# EAGLE design dual_encoder_i2c_shield_revA (EAGLE 8.6.0)
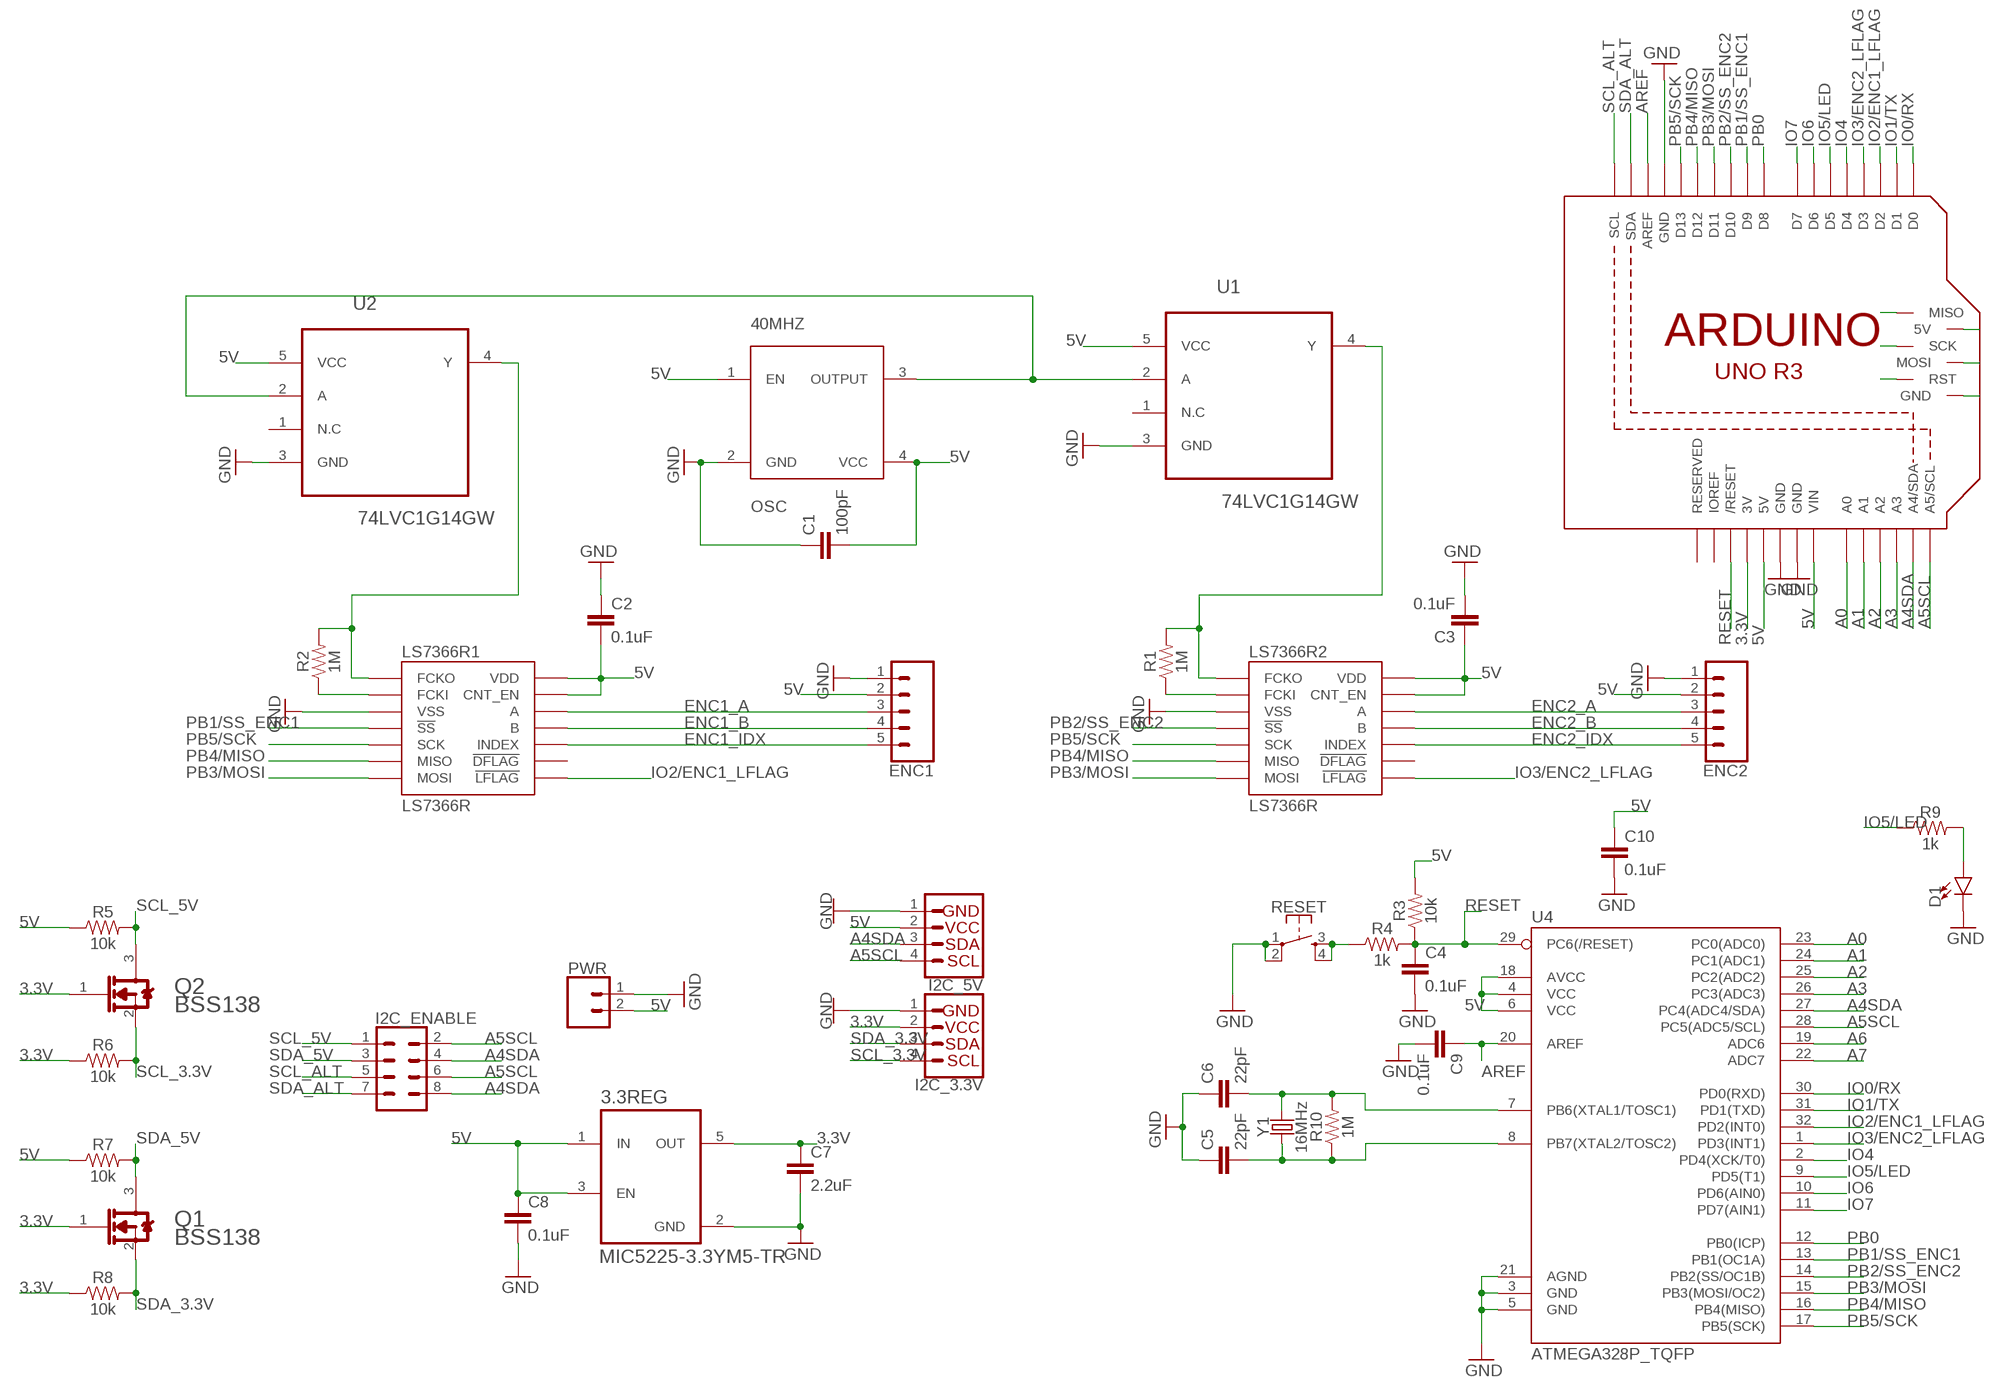
[diagram p0: schematic, sheet 1]

## Parts
3.3REG  MIC5225-3.3YM5-TR  [SOT95P280X145-5N]
40MHZ  OSC  [CB3OSCILLATOR]
C1  100pF  100PF-0603-50V-5%  [0603]
C2  0.1uF  0.1UF-0603-25V-5%  [0603]
C3  0.1uF  0.1UF-0603-25V-5%  [0603]
C4  0.1uF  0.1UF-0603-25V-5%  [0603]
C5  22pF  22PF-0603-50V-5%  [0603]
C6  22pF  22PF-0603-50V-5%  [0603]
C7  2.2uF  2.2UF-0603-10V-20%  [0603]
C8  0.1uF  0.1UF-0603-25V-5%  [0603]
C9  0.1uF  0.1UF-0603-25V-5%  [0603]
C10  0.1uF  0.1UF-0603-25V-5%  [0603]
D1  LED0603  [LED-0603]
ENC1  CONN_05  [1X05]
ENC2  CONN_05  [1X05]
I2C_3.3V  QWIIC_CONNECTORJS-1MM  [JST04_1MM_RA]
I2C_5V  QWIIC_CONNECTORJS-1MM  [JST04_1MM_RA]
I2C_ENABLE  CONN_04X2  [2X4]
LS7366R1  LS7366R  [SOIC14]
LS7366R2  LS7366R  [SOIC14]
M1  ARDUINO_R3_ICSP  [ARDUINOR3_ICSP]
PWR  CONN_02-JST-2MM-SMT  [JST-2-SMD]
Q1  ON_SEMI_BSS138ON_SEMI_BSS138_0_0  [ON_SEMI_BSS138_0]
Q2  ON_SEMI_BSS138ON_SEMI_BSS138_0_0  [ON_SEMI_BSS138_0]
R1  1M  1MOHM-0603-1/4W-5%  [0603]
R2  1M  1MOHM-0603-1/4W-5%  [0603]
R3  10k  10KOHM-0603-1/10W-1%  [0603]
R4  1k  1KOHM-0603-1/10W-1%  [0603]
R5  10k  10KOHM-0603-1/10W-1%  [0603]
R6  10k  10KOHM-0603-1/10W-1%  [0603]
R7  10k  10KOHM-0603-1/10W-1%  [0603]
R8  10k  10KOHM-0603-1/10W-1%  [0603]
R9  1k  1KOHM-0603-1/10W-1%  [0603]
R10  1M  1MOHM-0603-1/4W-5%  [0603]
RESET  MOMENTARY-SWITCH-SPST-2-SMD-5.2MM  [TACTILE_SWITCH_SMD_5.2MM]
U1  74LVC1G14GW  [SOT65P210X110-5N]
U2  74LVC1G14GW  [SOT65P210X110-5N]
U4  ATMEGA328P_TQFP  [TQFP32-08]
Y1  16MHz  CRYSTAL-16MHZPTH-HC49US  [HC49US]

## Nets
3.3V: 3.3REG.5(OUT) C7.1 I2C_3.3V.2 M1.3V Q1.1(G) Q2.1(G) R6.1 R8.1
5V: 3.3REG.1(IN) 3.3REG.3(EN) 40MHZ.1(EN) 40MHZ.4(VCC) C1.2 C2.2 C3.1 C8.1 C10.1 ENC1.2 ENC2.2 I2C_5V.2 LS7366R1.13(CNT_EN) LS7366R1.14(VDD) LS7366R2.13(CNT_EN) LS7366R2.14(VDD) M1.5V M1.5V_ICSP(5V) M1.VIN PWR.2 R3.2 R5.1 R7.1 U1.5(VCC) U2.5(VCC) U4.4(VCC) U4.6(VCC) U4.18(AVCC)
A0: M1.A0 U4.23(PC0(ADC0))
A1: M1.A1 U4.24(PC1(ADC1))
A2: M1.A2 U4.25(PC2(ADC2))
A3: M1.A3 U4.26(PC3(ADC3))
A4SDA: I2C_5V.3 I2C_ENABLE.4 I2C_ENABLE.8 M1.A4(A4/SDA) U4.27(PC4(ADC4/SDA))
A5SCL: I2C_5V.4 I2C_ENABLE.2 I2C_ENABLE.6 M1.A5(A5/SCL) U4.28(PC5(ADC5/SCL))
A6: U4.19(ADC6)
A7: U4.22(ADC7)
AREF: C9.1 M1.AREF U4.20(AREF)
ENC1_A: ENC1.3 LS7366R1.12(A)
ENC1_B: ENC1.4 LS7366R1.11(B)
ENC1_IDX: ENC1.5 LS7366R1.10(INDEX)
ENC2_A: ENC2.3 LS7366R2.12(A)
ENC2_B: ENC2.4 LS7366R2.11(B)
ENC2_IDX: ENC2.5 LS7366R2.10(INDEX)
GND: 3.3REG.2(GND) 40MHZ.2(GND) C1.1 C2.1 C3.2 C4.2 C5.1 C6.1 C7.2 C8.2 C9.2 C10.2 D1.C ENC1.1 ENC2.1 I2C_3.3V.1 I2C_5V.1 LS7366R1.3(VSS) LS7366R2.3(VSS) M1.GND M1.GND@1(GND) M1.GND@2(GND) M1.GND@3(GND) PWR.1 RESET.1 RESET.2 U1.3(GND) U2.3(GND) U4.3(GND) U4.5(GND) U4.21(AGND)
IO0/RX: M1.D0 U4.30(PD0(RXD))
IO1/TX: M1.D1 U4.31(PD1(TXD))
IO2/ENC1_LFLAG: LS7366R1.8(!LFLAG) M1.D2 U4.32(PD2(INT0))
IO3/ENC2_LFLAG: LS7366R2.8(!LFLAG) M1.D3 U4.1(PD3(INT1))
IO4: M1.D4 U4.2(PD4(XCK/T0))
IO5/LED: M1.D5 R9.1 U4.9(PD5(T1))
IO6: M1.D6 U4.10(PD6(AIN0))
IO7: M1.D7 U4.11(PD7(AIN1))
N$2: R4.1 RESET.3 RESET.4
N$3: D1.A R9.2
N$5: C6.2 R10.2 U4.7(PB6(XTAL1/TOSC1)) Y1.2
N$6: LS7366R1.2(FCKI) R2.1
N$7: 40MHZ.3(OUTPUT) U1.2(A) U2.2(A)
N$8: LS7366R2.1(FCKO) R1.2 U1.4(Y)
N$9: LS7366R2.2(FCKI) R1.1
N$10: LS7366R1.1(FCKO) R2.2 U2.4(Y)
N$11: C5.2 R10.1 U4.8(PB7(XTAL2/TOSC2)) Y1.1
PB0: M1.D8 U4.12(PB0(ICP))
PB1/SS_ENC1: LS7366R1.4(!SS) M1.D9 U4.13(PB1(OC1A))
PB2/SS_ENC2: LS7366R2.4(!SS) M1.D10 U4.14(PB2(SS/OC1B))
PB3/MOSI: LS7366R1.7(MOSI) LS7366R2.7(MOSI) M1.D11 M1.MOSI U4.15(PB3(MOSI/OC2))
PB4/MISO: LS7366R1.6(MISO) LS7366R2.6(MISO) M1.D12 M1.MISO U4.16(PB4(MISO))
PB5/SCK: LS7366R1.5(SCK) LS7366R2.5(SCK) M1.D13 M1.SCK U4.17(PB5(SCK))
RESET: C4.1 M1.RESET(/RESET) M1.RESET_ICSP(RST) R3.1 R4.2 U4.29(PC6(/RESET))
SCL_3.3V: I2C_3.3V.4 Q2.2(S) R6.2
SCL_5V: I2C_ENABLE.1 Q2.3(D) R5.2
SCL_ALT: I2C_ENABLE.5 M1.SCL
SDA_3.3V: I2C_3.3V.3 Q1.2(S) R8.2
SDA_5V: I2C_ENABLE.3 Q1.3(D) R7.2
SDA_ALT: I2C_ENABLE.7 M1.SDA
Unconnected: LS7366R1.9(!DFLAG) LS7366R2.9(!DFLAG) M1.IOREF M1.RESERVED U1.1(N.C) U2.1(N.C)

## Library data of the parts
3.3REG = MIC5225-3.3YM5-TR:MIC5225-3.3YM5-TR: MIC5225 Series 150 mA 3.3 V Fixed Output Surface Mount LDO Regulator SOT-23-5; AVAILABILITY: Unavailable; DESCRIPTION: Linear Voltage Regulator IC 1 Output 150mA SOT-23-5; MF: Microchip; MP: MIC5225-3.3YM5-TR; PACKAGE: SOT-23 Microchip; PRICE: None
40MHZ = steveo:OSC: CB3 40mhz Oscillator smd
C1 = SparkFun-Capacitors:100PF: 100pF/0.1nF ceramic capacitors A capacitor is a passive two-terminal electrical component used to store electrical energy temporarily in an electric field.; PROD_ID: CAP-07883
C2-C4 C8-C10 = SparkFun-Capacitors:0.1UF: 0.1µF ceramic capacitors A capacitor is a passive two-terminal electrical component used to store electrical energy temporarily in an electric field.; PROD_ID: CAP-08604
C5 C6 = SparkFun-Capacitors:22PF: 22pF ceramic capacitors A capacitor is a passive two-terminal electrical component used to store electrical energy temporarily in an electric field.; PROD_ID: CAP-07876
C7 = SparkFun-Capacitors:2.2UF: 2.2µF ceramic capacitors A capacitor is a passive two-terminal electrical component used to store electrical energy temporarily in an electric field.; PROD_ID: CAP-07888
D1 = SparkFun-LED:LED: LED (Generic) Standard schematic elements and footprints for 5mm, 3mm, 1206, and 0603 sized LEDs. Generic LEDs with no color specified.
ENC1 ENC2 = SparkFun-Connectors:CONN_05: Multi connection point. Often used as Generic Header-pin footprint for 0.1 inch spaced/style header connections On any of the 0.1 inch spaced packages, you can populate with these: Break Away Headers - Straight <https://www.sparkfun.com/products/116> (PRT-00116) Break Away Male Headers - Right Angle <https://www.sparkfun.com/products/553> (PRT-00553) Female Headers <https://www.sparkfun.com/products/115> (PRT-00115) Break Away Headers - Machine Pin <https://www.sparkfun.com/products/117> (PRT-00117) Break Away Female Headers - Swiss Machine Pin <https://www.sparkfun.com/products/743> (PRT-00743) For SCREWTERMINALS and SPRING TERMINALS visit here: Screw Terimnals on SparkFun.com <https://www.sparkfun.com/search/results?term=Screw+Terminals> (5mm/3.5mm/2.54mm spacing) This device is also useful as a general connection point to wire up your design to another part of your project. Our various solder wires solder well into these plated through hole pads. Hook-Up Wire - Assortment (Stranded, 22 AWG) <https://www.sparkfun.com/products/11375> (PRT-11375) Hook-Up Wire - Assortment (Solid Core, 22 AWG) <https://www.sparkfun.com/products/11367> (PRT-11367) View the entire wire category on our website here <https://www.sparkfun.com/categories/141> Special notes: Molex polarized connector foot print use with SKU : PRT-08231 with associated crimp pins and housings. 1MM SMD Version SKU: PRT-10208
I2C_3.3V I2C_5V = SparkFun-Connectors:QWIIC_CONNECTOR: SparkFun I2C Standard Qwiic Connector An SMD 1mm pitch JST connector makes it easy and quick (get it? Qwiic?) to connect I2C devices to each other. The Qwiic system <http://www.sparkfun.com/qwiic> enables fast and solderless connection between popular platforms and various sensors and actuators. We carry 200mm <https://www.sparkfun.com/products/14204>, 100mm <https://www.sparkfun.com/products/14205>, 50mm <https://www.sparkfun.com/products/14206>, and breadboard friendly <https://www.sparkfun.com/products/14207> Qwiic cables. We also offer 10 pcs strips <https://www.sparkfun.com/products/14323> the SMD connectors.; PROD_ID: CONN-13694
I2C_ENABLE = SparkFun-Connectors:CONN_04X2: Multi connection point. Often used as Generic Header-pin footprint for 0.1 inch spaced/style header connections On any of the 0.1 inch spaced packages, you can populate with these: Break Away Headers - Straight <https://www.sparkfun.com/products/116> (PRT-00116) Break Away Male Headers - Right Angle <https://www.sparkfun.com/products/553> (PRT-00553) Female Headers <https://www.sparkfun.com/products/115> (PRT-00115) Break Away Headers - Machine Pin <https://www.sparkfun.com/products/117> (PRT-00117) Break Away Female Headers - Swiss Machine Pin <https://www.sparkfun.com/products/743> (PRT-00743)
LS7366R1 LS7366R2 = LS7366R:LS7366R; AVAILABILITY: Unavailable; MF: LSI; MP: LS7366R; PACKAGE: None; PRICE: None
M1 = adafruit:ARDUINO_R3_ICSP
PWR = SparkFun-Connectors:CONN_02: Multi connection point. Often used as Generic Header-pin footprint for 0.1 inch spaced/style header connections On any of the 0.1 inch spaced packages, you can populate with these: Break Away Headers - Straight <https://www.sparkfun.com/products/116> (PRT-00116) Break Away Male Headers - Right Angle <https://www.sparkfun.com/products/553> (PRT-00553) Female Headers <https://www.sparkfun.com/products/115> (PRT-00115) Break Away Headers - Machine Pin <https://www.sparkfun.com/products/117> (PRT-00117) Break Away Female Headers - Swiss Machine Pin <https://www.sparkfun.com/products/743> (PRT-00743) For SCREWTERMINALS and SPRING TERMINALS visit here: Screw Terimnals on SparkFun.com <https://www.sparkfun.com/search/results?term=Screw+Terminals> (5mm/3.5mm/2.54mm spacing) This device is also useful as a general connection point to wire up your design to another part of your project. Our various solder wires solder well into these plated through hole pads. Hook-Up Wire - Assortment (Stranded, 22 AWG) <https://www.sparkfun.com/products/11375> (PRT-11375) Hook-Up Wire - Assortment (Solid Core, 22 AWG) <https://www.sparkfun.com/products/11367> (PRT-11367) View the entire wire category on our website here <https://www.sparkfun.com/categories/141> Special notes: Molex polarized connector foot print use with: PRT-08233 with associated crimp pins and housings. 2.54_SCREWTERM for use with PRT-10571. 3.5mm Screw Terminal footprints for PRT-08084 5mm Screw Terminal footprints for use with PRT-08432; PROD_ID: CONN-11443
Q1 Q2 = ON Semi - BSS138:ON_SEMI_BSS138: N-Channel Logic Level Enhancement Mode Field Effect Transistor; CENTROID_NOT_SPECIFIED: No; DATASHEET: https://www.fairchildsemi.com/datasheets/BS/BSS138.pdf; DIGIKEY_DESCRIPTION: TRANS MOSFET N-CH 50V 220MA SOT-23; DIGIKEY_PART_NUMBER: BSS138CT-ND; LEAD_FREE: yes; MF: ON Semi; MFG_PACKAGE_IDENT: BSS138; MFG_PACKAGE_IDENT_DATE: 0; MFG_PACKAGE_IDENT_REV: 0; MOUSER_DESCRIPTION: MOSFET SOT-23 N-CH LOGIC; MOUSER_PART_NUMBER: 512-BSS138; MPN: BSS138; PACKAGE: SOT23; PREFIX: Q; ROHS: yes; TEMPERATURE_RANGE_HIGH: +150°C; TEMPERATURE_RANGE_LOW: -55°C
R1 R2 R10 = SparkFun-Resistors:1MOHM: 1MΩ resistor A resistor is a passive two-terminal electrical component that implements electrical resistance as a circuit element. Resistors act to reduce current flow, and, at the same time, act to lower voltage levels within circuits. - Wikipedia; PROD_ID: RES-07868
R3 R5-R8 = SparkFun-Resistors:10KOHM: 10kΩ resistor A resistor is a passive two-terminal electrical component that implements electrical resistance as a circuit element. Resistors act to reduce current flow, and, at the same time, act to lower voltage levels within circuits. - Wikipedia; PROD_ID: RES-00824
R4 R9 = SparkFun-Resistors:1KOHM: 1kΩ resistor A resistor is a passive two-terminal electrical component that implements electrical resistance as a circuit element. Resistors act to reduce current flow, and, at the same time, act to lower voltage levels within circuits. - Wikipedia; PROD_ID: RES-07856
RESET = SparkFun-Switches:MOMENTARY-SWITCH-SPST-2: Momentary Switch (Pushbutton) - SPST - Two Circuits Normally-open (NO) SPST momentary switches (buttons, pushbuttons). Schematic symbol includes two switch circuits. Variants SMD-4.6MMX2.8MM - 4.60mm x 2.80mm Tactile Momentary Button Switch - Used on SparkFun SAMD21 Mini Breakout <https://www.sparkfun.com/products/13664> SMD-5.2MM - Mini Pushbutton Switch - SMD <https://www.sparkfun.com/products/8720> - Used on Arduino Pro Mini <https://www.sparkfun.com/products/11114>; PROD_ID: SWCH-08247; SF_SKU: COM-08720
U1 U2 = 74LVC1G14GW:74LVC1G14GW: Single Schmitt-trigger inverter; AVAILABILITY: Unavailable; DESCRIPTION: IC MOS 74LVC1G14/SO/74LVC1G14GW PHILIPS RoHS LVC SOt23; MF: NXP Semiconductors; MP: 74LVC1G14GW; PACKAGE: TSSOP-5 NXP Semiconductors; PRICE: 214.47 USD
U4 = SparkFun-IC-Microcontroller:ATMEGA328P_TQFP: Popular 328P in QFP Storefront component: ATmega328 - TQFP <https://www.sparkfun.com/products/13448> (COM-13448) Datasheet <http://www.sparkfun.com/datasheets/Components/SMD/ATMega328.pdf> SparkFun Products SparkFun RedBoard - Programmed with Arduino <https://www.sparkfun.com/products/12757> (DEV-12757) Arduino Pro Mini 328 - 5V/16MHz <https://www.sparkfun.com/products/11113> (DEV-11113) Arduino Pro Mini 328 - 3.3V/8MHz <https://www.sparkfun.com/products/11114> (DEV-11114) SparkFun OpenLog <https://www.sparkfun.com/products/13712> (DEV-13712) SparkFun MicroView - OLED Arduino Module <https://www.sparkfun.com/products/12923> (DEV-12923) SparkFun Digital Sandbox <https://www.sparkfun.com/products/12651> (DEV-12651) SparkFun PicoBoard <https://www.sparkfun.com/products/11888> (WIG-11888) Arduino Fio <https://www.sparkfun.com/products/10116> (DEV-10116) LilyPad Arduino 328 Main Board <https://www.sparkfun.com/products/13342> (DEV-13342) SparkFun RedStick <https://www.sparkfun.com/products/13741> (DEV-13741) LilyPad MP3 <https://www.sparkfun.com/products/11013> (DEV-11013) LilyPad Arduino SimpleSnap <https://www.sparkfun.com/products/10941> (DEV-10941) SparkFun Stepoko <https://www.sparkfun.com/products/13899> (ROB-13899) SparkFun Geiger Counter <https://www.sparkfun.com/products/11345> (SEN-11345) SparkFun EL Sequencer <https://www.sparkfun.com/products/12781> (COM-12781) Arduino Pro 328 - 5V/16MHz <https://www.sparkfun.com/products/10915> (DEV-10915) CryptoCape <https://www.sparkfun.com/products/12773> (DEV-12773) SparkFun IR Thermometer Evaluation Board - MLX90614 <https://www.sparkfun.com/products/10740> (SEN-10740) SparkFun RedBot Mainboard <https://www.sparkfun.com/products/12097> (ROB-12097) Arduino Pro 328 - 3.3V/8MHz <https://www.sparkfun.com/products/10914> (DEV-10914) SparkFun Block for Intel® Edison - Arduino <https://www.sparkfun.com/products/13036> (DEV-13036) SparkFun Simon Says - Surface Mount Soldering Kit <https://www.sparkfun.com/products/10935> (KIT-10935) SparkFun 7-Segment Serial Display - Red <https://www.sparkfun.com/products/11441> (COM-11441) SparkFun 7-Segment Serial Display - White <https://www.sparkfun.com/products/11629> (COM-11629) SparkFun 7-Segment Serial Display - Yellow <https://www.sparkfun.com/products/11443> (COM-11443) SparkFun 7-Segment Serial Display - Kelly Green <https://www.sparkfun.com/products/11440> (COM-11440) SparkFun 7-Segment Serial Display - Blue <https://www.sparkfun.com/products/11442> (COM-11442) SparkFun OpenSegment Serial Display - 20mm (Blue) <https://www.sparkfun.com/products/11647> (COM-11647) SparkFun OpenSegment Serial Display - 20mm (Green) <https://www.sparkfun.com/products/11646> (COM-11646) SparkFun OpenSegment Serial Display - 20mm (White) <https://www.sparkfun.com/products/11648> (COM-11648) SparkFun OpenSegment Serial Display - 20mm (Red) <https://www.sparkfun.com/products/11644> (COM-11644) SparkFun OpenSegment Serial Display - 20mm (Yellow) <https://www.sparkfun.com/products/11645> (COM-11645) SparkFun OpenSegment Shield <https://www.sparkfun.com/products/13190> (DEV-13190); PROD_ID: IC-09069
Y1 = SparkFun-Clocks:CRYSTAL-16MHZ: 16MHz Crystal Digikey Example <http://www.digikey.com/product-search/en?keywords=535-9122-1-ND> Frequency: 16MHz Frequency Stability: ±50ppm Frequency Tolerance: ±20ppm Load Capacitance: 18pF SparkFun Products: Pro Micro -5V/16MHz <https://www.sparkfun.com/products/12640> SparkFun Serial Enabled LCD Kit <https://www.sparkfun.com/products/10097>; PROD_ID: XTAL-08181; SF_ID: COM-00536

## Board
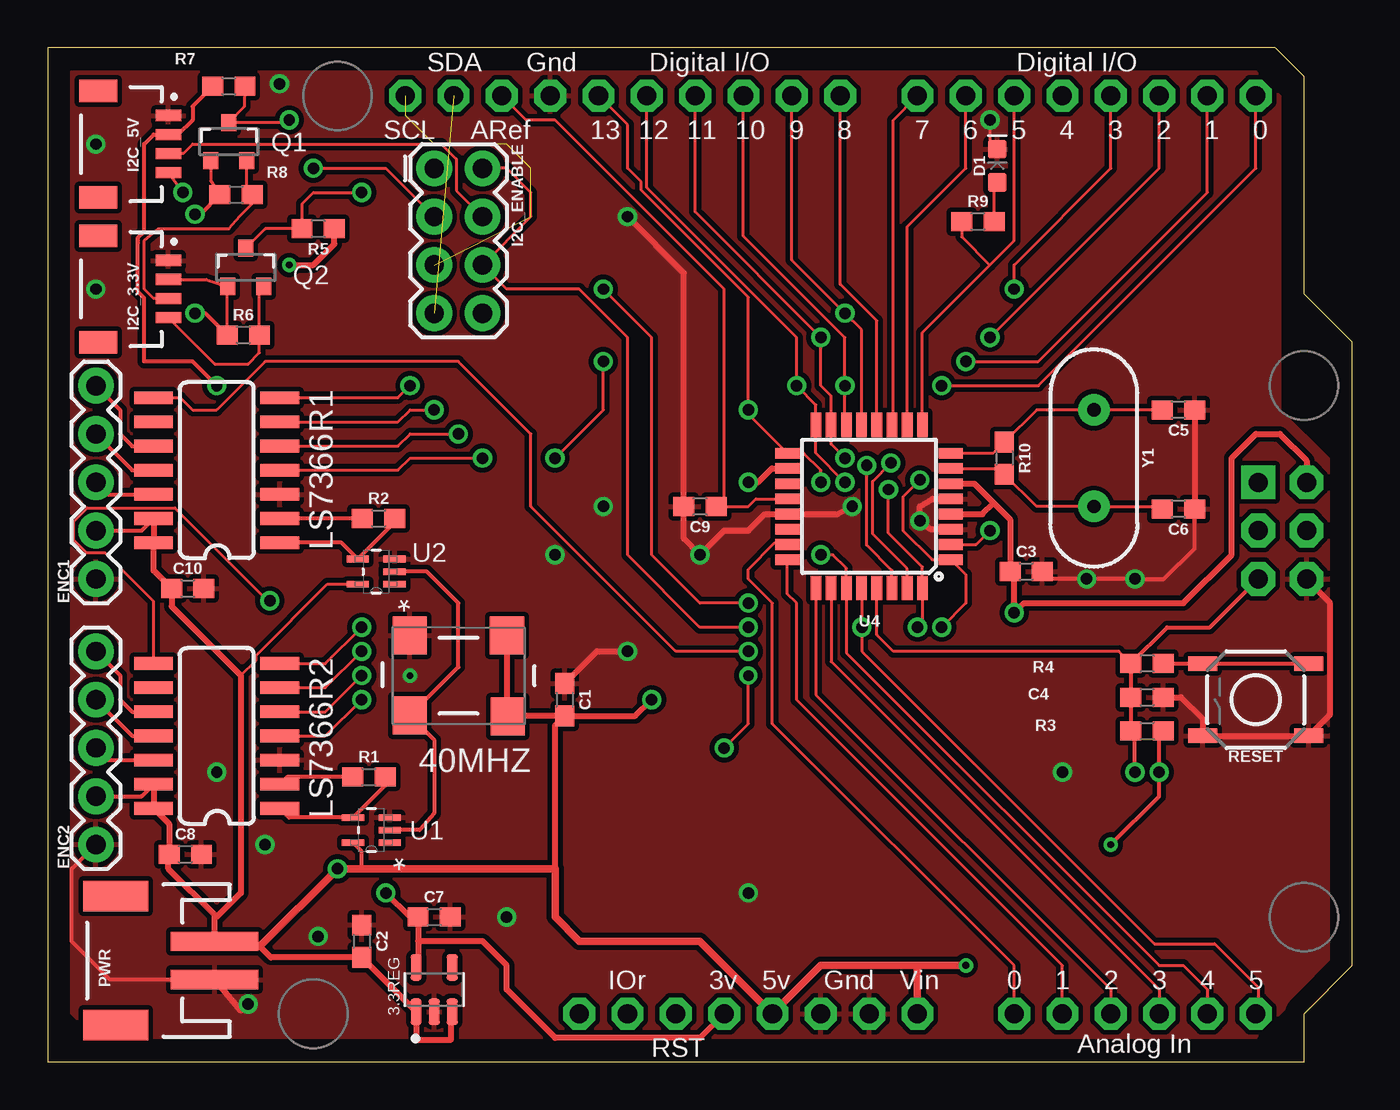
[diagram p1: board, top side]
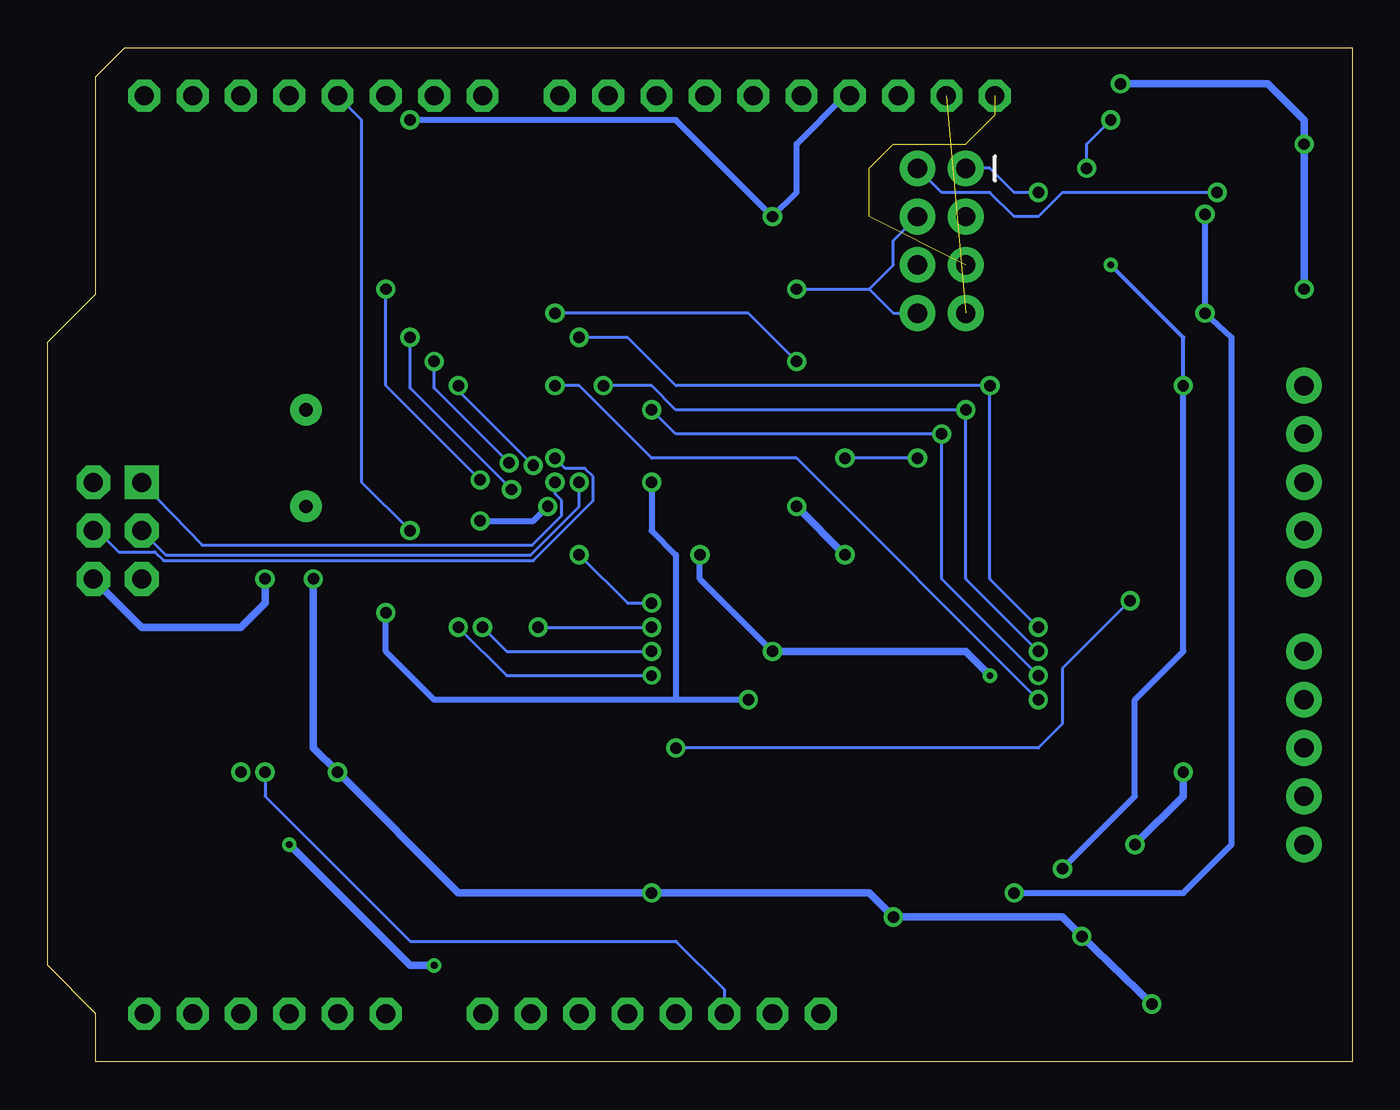
[diagram p2: board, bottom side, seen from below]

Size 68.58 x 53.34 mm. Coordinates in mm from the lower left corner, seen from the top.
Copper layers (1*16): Top 0.035mm / dielectric 1.5mm / Bottom 0.035mm
Design rules "default": minimum track width 6mil, minimum drill 0.35mm, track to track 6mil, track to pad 6mil, pad to pad 6mil, via to via 6mil, smd to smd 6mil, copper to edge 40mil, drill to drill 6mil, minimum pad ring 10mil, minimum via ring 8mil, stop-mask expansion 4mil, vias tented up to drill 0mil, thermal gap 10mil

### Footprints (pad centres in the part's own frame; a part is rotated, then mirrored left to right if it is on the bottom)
SOT95P280X145-5N = smd 1.39 x 0.58: 1 -1.165,0.95; 2 -1.165,0; 3 -1.165,-0.95; 4 1.165,-0.95; 5 1.165,0.95
CB3OSCILLATOR = smd 1.8 x 2: 1 -2.55,-2.1; 2 2.55,-2.1; 3 2.55,2.1; 4 -2.6,2.15
0603 = smd 1.1 x 1: 1 -0.85,0; 2 0.85,0
LED-0603 = smd 1 x 1: A -0.877,0; C 0.877,0
1X05 = drill 1.016 pad 1.88: 1 0,0; 2 2.54,0; 3 5.08,0; 4 7.62,0; 5 10.16,0
JST04_1MM_RA = smd 0.6 x 1.35: 1 -1.5,0; 2 -0.5,0; 3 0.5,0; 4 1.5,0 | smd 1.2 x 2: NC1 2.8,-3.675; NC2 -2.8,-3.675
2X4 = drill 1.016 pad 1.88: 1 -3.81,-1.27; 2 -3.81,1.27; 3 -1.27,-1.27; 4 -1.27,1.27; 5 1.27,-1.27; 6 1.27,1.27; 7 3.81,-1.27; 8 3.81,1.27
SOIC14 = smd 2.032 x 0.66: 1 -3.315,4.445; 2 -3.315,3.175; 3 -3.315,1.905; 4 -3.315,0.635; 5 -3.315,-0.635; 6 -3.315,-1.905; 7 -3.315,-3.175; 8 3.315,-3.175; 9 3.315,-1.905; 10 3.315,-0.635; 11 3.315,0.635; 12 3.315,1.905; 13 3.315,3.175; 14 3.315,4.445
ARDUINOR3_ICSP = drill 1 pad 1.676 octagon: 3V 35.56,2.54; 5V 38.1,2.54; A0 50.8,2.54; A1 53.34,2.54; A2 55.88,2.54; A3 58.42,2.54; A4 60.96,2.54; A5 63.5,2.54; AREF 23.876,50.8; D0 63.5,50.8; D1 60.96,50.8; D2 58.42,50.8; D3 55.88,50.8; D4 53.34,50.8; D5 50.8,50.8; D6 48.26,50.8; D7 45.72,50.8; D8 41.656,50.8; D9 39.116,50.8; D10 36.576,50.8; D11 34.036,50.8; D12 31.496,50.8; D13 28.956,50.8; GND 26.416,50.8; GND@1 43.18,2.54; GND@2 40.64,2.54; IOREF 30.48,2.54; RESERVED 27.94,2.54; RESET 33.02,2.54; SCL 18.796,50.8; SDA 21.336,50.8; VIN 45.72,2.54 | drill 1 pad 1.778 octagon: 5V_ICSP 66.167,30.48; GND@3 66.167,25.4; MOSI 66.167,27.94; RESET_ICSP 63.627,25.4; SCK 63.627,27.94 | drill 1 pad 1.778 square: MISO 63.627,30.48
JST-2-SMD = smd 1 x 4.6: 1 -1,-3.7; 2 1,-3.7 | smd 1.6 x 3.4: NC1 -3.4,1.5; NC2 3.4,1.5
ON_SEMI_BSS138_0 = smd 0.8 x 0.9: 1 -0.95,-1; 2 0.95,-1; 3 0,1
TACTILE_SWITCH_SMD_5.2MM = smd 1.524 x 0.762: 1 -2.794,1.905; 2 2.794,1.905; 3 -2.794,-1.905; 4 2.794,-1.905
SOT65P210X110-5N = smd 1.168 x 0.356: 1 -0.965,0.66; 2 -0.965,0; 3 -0.965,-0.66; 4 0.965,-0.66; 5 0.965,0.66
TQFP32-08 = smd 1.27 x 0.559: 1 -4.293,2.8; 2 -4.293,2; 3 -4.293,1.2; 4 -4.293,0.4; 5 -4.293,-0.4; 6 -4.293,-1.2; 7 -4.293,-2; 8 -4.293,-2.8; 17 4.293,-2.8; 18 4.293,-2; 19 4.293,-1.2; 20 4.293,-0.4; 21 4.293,0.4; 22 4.293,1.2; 23 4.293,2; 24 4.293,2.8 | smd 0.559 x 1.27: 9 -2.8,-4.293; 10 -2,-4.293; 11 -1.2,-4.293; 12 -0.4,-4.293; 13 0.4,-4.293; 14 1.2,-4.293; 15 2,-4.293; 16 2.8,-4.293; 25 2.8,4.293; 26 2,4.293; 27 1.2,4.293; 28 0.4,4.293; 29 -0.4,4.293; 30 -1.2,4.293; 31 -2,4.293; 32 -2.8,4.293
HC49US = drill 0.7 pad 1.651: 1 -2.54,0; 2 2.54,0

### Placement (x,y rotation side)
3.3REG  20.32,3.81 90 top
40MHZ  21.59,20.32 180 top
C1  27.18,19.05 270 top
C2  16.51,6.35 270 top
C3  51.44,25.78 0 top
C4  57.78,19.18 0 top
C5  59.44,34.29 180 top
C6  59.44,29.08 180 top
C7  20.32,7.62 0 top
C8  7.24,10.92 0 top
C9  34.29,29.21 180 top
C10  7.37,24.89 0 top
D1  49.91,47.12 90 top
ENC1  2.54,25.4 90 top
ENC2  2.54,11.43 90 top
I2C_3.3V  6.35,40.64 270 top
I2C_5V  6.35,48.26 270 top
I2C_ENABLE  21.59,43.18 270 top
LS7366R1  8.89,31.75 180 top
LS7366R2  8.89,17.78 180 top
M1  0,0 0 top
PWR  5.08,5.33 90 top
Q1  9.53,48.39 0 top
Q2  10.41,41.78 0 top
R1  16.89,14.99 0 top
R2  17.4,28.57 0 top
R3  57.78,17.4 0 top
R4  57.78,20.95 180 top
R5  14.22,43.81 180 top
R6  10.29,38.23 0 top
R7  9.53,51.31 0 top
R8  9.91,45.59 0 top
R9  48.9,44.2 0 top
R10  50.29,31.75 270 top
RESET  63.5,19.05 180 top
U1  17.02,12.19 180 top
U2  17.27,25.78 180 top
U4  43.18,29.21 180 top
Y1  54.99,31.75 270 top

### Tracks (layer width: path | path; a pad name or v marks a point on that pad's centre or on a via)
3.3V  (via drill 0.6)
  Top 0.152: Q1.1 8.57,46.33 R8.1 | I2C_3.3V.2 8.35,41.14 8.98,40.94 | 8.98,40.94 Q2.1 | R6.1 9.44,40.48 8.98,40.94
  Top 0.203: v7.75,44.58 8.04,44.58 R8.1 | R6.1 8.29,39.37 v7.75,39.37
  Top 0.305: 19.47,6.35 C7.1 19.05,7.62 v17.78,8.89 | 19.47,6.35 19.47,5.08 3.3REG.5 19.37,4.76 | M1.3V 34.29,1.27 26.67,1.27 24.13,3.81 24.13,5.08 22.86,6.35 19.47,6.35
  Bottom 0.305: v17.78,8.89 8.89,8.89 6.35,11.43 6.35,38.1 v7.75,39.37 v7.75,44.58
5V  (via drill 0.35, 0.6)
  Top 0.152: 10.16,20.32 10.96,21.12 10.96,21.38 14.7,25.12 U2.5
  Top 0.203: ENC2.2 4.94,13.97 LS7366R2.13 | ENC1.2 4.94,27.94 LS7366R1.13 | 16.51,10.16 16.51,11.07 U1.5 | R7.1 7.62,50.25 7.62,49.53 6.85,48.76 I2C_5V.2 5.58,48.76 5.08,48.26 5.08,43.66 4.75,43.33 4.75,43.2 4.74,43.07 4.75,43.06 4.75,40.5 5.08,40.17 5.08,36.83 7.62,36.83 v8.89,35.56 | R3.2 58.42,17.18 v58.42,15.24 58.42,13.97 v55.88,11.43
  Top 0.305: LS7366R2.13 LS7366R2.14 6.39,12.52 C8.1 6.35,10.88 6.35,10.16 8.78,7.73 | LS7366R1.13 LS7366R1.14 5.58,25.83 C10.1 6.52,23.96 10.16,20.32 10.16,8.89 8.89,7.62 8.78,7.73 | 40MHZ.1 24.14,18.22 24.16,18.2 | 24.16,18.2 40MHZ.4 | C1.2 24.16,18.2 | PWR.2 8.78,7.73 | 3.3REG.3 21.21,2.58 21.21,1.17 19.43,1.17 19.37,1.23 3.3REG.1 C2.2 11.74,5.5 11.16,6.08 | 26.67,10.16 26.67,17.69 C1.2 | 50.42,25.61 C3.1 | C3.1 50.59,28.54 49.72,29.4 | C1.2 30.9,18.2 v31.75,19.05 | U4.6 48.71,30.41 49.72,29.4 | U4.4 49.13,28.81 49.72,29.4 | C3.1 50.8,25.57 v50.8,23.62 51.31,24.13 59.69,24.13 62.23,26.67 62.23,31.75 63.5,33.02 64.77,33.02 66.17,31.62 M1.5V_ICSP | v36.83,30.48 37.34,30.48 38.07,31.21 U4.18 | v12.7,41.91 13.97,41.91 15.07,43.01 R5.1
  Top 0.406: PWR.2 11.16,6.08 v15.24,10.16 16.51,10.16 26.67,10.16 26.67,7.62 27.94,6.35 34.29,6.35 M1.5V 40.64,5.08 45.72,5.08 | 45.72,5.08 M1.VIN | 45.72,5.08 v48.26,5.08
  Bottom 0.203: v8.89,35.56 8.89,38.1 v12.7,41.91
  Bottom 0.305: v31.75,19.05 35.56,19.05 | 35.56,19.05 48.26,19.05 50.8,21.59 v50.8,23.62 | v36.83,30.48 36.83,27.94 35.56,26.67 35.56,19.05 | v15.24,10.16 11.43,13.97 11.43,19.05 8.89,21.59 v8.89,35.56
  Bottom 0.406: v48.26,5.08 49.53,5.08 v55.88,11.43
A0
  Top 0.152: M1.A0 50.8,5.08 38.1,17.78 38.1,24.13 36.83,25.4 36.83,25.91 38.23,27.3 38.32,27.21 U4.23
A1
  Top 0.152: M1.A1 53.34,5.08 39.37,19.05 39.37,24.13 38.89,24.61 U4.24
A2
  Top 0.152: U4.25 40.38,19.31 55.88,3.81 M1.A2
A3
  Top 0.152: U4.26 41.18,21.05 58.42,3.81 M1.A3
A4SDA  (via drill 0.6)
  Top 0.152: I2C_5V.3 7.12,47.76 7.62,48.26 20.7,48.26 21.49,47.47 21.49,45.82 I2C_ENABLE.4 | M1.A4 60.96,3.81 59.69,5.08 58.42,5.08 41.98,21.52 U4.27 41.98,25.96 41.27,26.67 v40.64,26.67 | v36.83,24.13 34.29,24.13 31.75,26.67 31.75,38.1 v29.21,40.64
  Bottom 0.152: v40.64,26.67 38.1,24.13 v36.83,24.13 | v29.21,40.64 25.4,40.64 | 25.4,40.64 24.13,39.37 I2C_ENABLE.8 | 25.4,40.64 24.13,41.91 24.13,43.18 I2C_ENABLE.4
A5SCL  (via drill 0.6)
  Top 0.152: v7.11,45.72 I2C_5V.4 | 42.82,24.37 U4.28 42.78,22.88 v42.8,22.86 42.8,21.59 58.17,6.22 61.34,6.22 63.63,3.94 63.63,2.67 M1.A5 | v36.83,22.86 34.29,22.86 30.48,26.67 30.48,38.1 27.94,40.64 24.13,40.64 I2C_ENABLE.6 25.4,44.45 25.4,45.72 24.13,46.99 I2C_ENABLE.2
  Bottom 0.152: v42.8,22.86 v36.83,22.86 | v7.11,45.72 15.24,45.72 16.51,44.45 17.78,44.45 19.05,45.72 21.59,45.72 I2C_ENABLE.2
AREF
  Top 0.152: C9.1 35.56,29.21 | 35.56,29.21 36.83,29.21 37.23,29.61 U4.20 | M1.AREF 25.15,49.53 26.67,49.53 35.56,40.64 35.56,29.21
ENC1_A
  Top 0.203: ENC1.3 3.17,29.84 LS7366R1.12
ENC1_B
  Top 0.203: ENC1.4 4.45,31.11 LS7366R1.11
ENC1_IDX
  Top 0.203: ENC1.5 3.81,34.29 3.81,33.02 4.45,32.38 LS7366R1.10
ENC2_A
  Top 0.203: ENC2.3 3.17,15.88 LS7366R2.12
ENC2_B
  Top 0.203: ENC2.4 4.45,17.14 LS7366R2.11
ENC2_IDX
  Top 0.203: ENC2.5 3.81,20.32 3.81,19.05 4.45,18.41 LS7366R2.10
GND  (via drill 0.35, 0.6)
  Top 0.152: v49.53,49.53 49.53,48.38 D1.C
  Top 0.203: PWR.1 3.29,4.33 1.27,6.35 1.27,10.16 ENC2.1 | C6.1 60.29,27.01 58.67,25.4 v57.15,25.4 v54.61,25.4 52.67,25.4 C3.2
  Top 0.305: v30.48,44.45 33.44,41.49 C9.2 33.44,27.52 v34.29,26.67 35.56,27.94 36.83,27.94 37.7,28.81 U4.21 41.51,28.81 v42.29,29.21 | C4.2 59.56,19.18 60.71,18.03 RESET.2 RESET.1 67.41,18.26 67.41,24.13 66.17,25.38 M1.GND@3 | C1.1 28.87,21.59 v30.48,21.59 | C5.1 C6.1 | PWR.1 10.16,2.7 v10.54,3.05 | U4.3 46.54,28.01 46.42,28 v45.85,28.45 45.85,29.21 46.5,29.61 U4.5
  Bottom 0.305: M1.GND 26.67,50.8 29.21,48.26 29.21,45.72 v30.48,44.45 35.56,49.53 v49.53,49.53 | v30.48,21.59 34.29,25.4 v34.29,26.67 | v45.85,28.45 43.05,28.45 v42.29,29.21
  Bottom 0.406: v10.54,3.05 v14.22,6.6 15.24,7.62 v24.13,7.62 25.4,8.89 v36.83,8.89 46.99,8.89 v53.34,15.24 54.61,16.51 v54.61,25.4 | v11.43,11.43 8.89,13.97 v8.89,15.24 | v19.05,20.32 20.32,21.59 v30.48,21.59 | M1.GND@3 63.63,22.86 58.42,22.86 57.15,24.13 v57.15,25.4 | v26.67,26.67 v29.21,29.21 | v12.19,51.44 4.45,51.44 2.54,49.53 v2.54,48.26 v2.54,40.64
  pour Top (isolate 0.254): 1.27,52.07 63.5,52.07 64.77,50.8 64.77,34.29 67.31,31.75 67.31,5.08 63.5,1.27 2.54,1.27 1.27,2.54
IO0/RX  (via drill 0.6)
  Top 0.152: U4.30 44.38,25.85 43.05,27.18 v43.05,31.37 | v46.99,35.56 52.07,35.56 63.5,46.99 M1.D0
  Bottom 0.152: v43.05,31.37 46.99,35.31 v46.99,35.56
IO1/TX  (via drill 0.6)
  Top 0.152: U4.31 45.18,25.94 43.36,27.76 43.36,30.53 v44.32,31.5 | v48.26,36.83 52.07,36.83 60.96,45.72 M1.D1
  Bottom 0.152: v44.32,31.5 48.26,35.43 v48.26,36.83
IO2/ENC1_LFLAG  (via drill 0.6)
  Top 0.152: LS7366R1.8 6.99,34.92 7.62,34.29 8.89,34.29 11.43,36.83 21.59,36.83 25.4,33.02 25.4,29.21 33.02,21.59 v36.83,21.59 | v45.72,22.86 45.98,23.12 U4.32 45.98,26.03 44.2,27.81 v44.2,30.1 | v49.53,38.1 58.42,46.99 M1.D2
  Bottom 0.152: v45.72,22.86 44.45,21.59 v36.83,21.59 | v44.2,30.1 49.53,35.43 v49.53,38.1
IO3/ENC2_LFLAG  (via drill 0.55, 0.6)
  Top 0.152: LS7366R2.8 5.58,24.22 3.02,26.77 2.06,26.77 1.37,27.46 1.37,28.42 2.08,29.13 6.69,29.13 11.69,24.13 v11.68,24.26 | v46.99,22.86 48.26,24.13 48.26,25.62 U4.1 46.49,26.41 44.96,27.94 44.96,29.72 v45.85,30.61 | v35.56,16.51 36.83,17.78 v36.83,20.32 | v50.8,40.64 50.8,41.91 55.88,46.99 M1.D3
  Bottom 0.152: v46.99,22.86 44.45,20.32 v36.83,20.32 | v11.68,24.26 15.24,20.7 15.24,17.78 16.51,16.51 v35.56,16.51 | v45.85,30.61 50.8,35.56 v50.8,40.64
IO4  (via drill 0.6)
  Top 0.152: U4.2 48.8,27.21 v49.53,27.94
  Bottom 0.152: v49.53,27.94 52.07,30.48 52.07,49.53 M1.D4
IO5/LED
  Top 0.152: U4.9 45.98,38.36 49.53,41.91 | 49.53,41.91 50.8,43.18 M1.D5 | R9.1 48.05,43.4 49.53,41.91
IO6
  Top 0.152: M1.D6 48.26,46.99 45.18,43.91 U4.10
IO7
  Top 0.152: U4.11 44.45,33.57 44.45,49.53 M1.D7
N$2
  Top 0.203: R4.1 RESET.4 RESET.3
N$3
  Top 0.152: R9.2 49.74,46.07 D1.A
N$5
  Top 0.152: C6.2 58.46,29.21 Y1.2 51.98,29.21 R10.2 49.98,31.21 U4.7
N$6
  Top 0.203: R2.1 LS7366R1.2
N$7
  Top 0.203: U2.2 19.94,25.78 21.59,24.13 21.59,20.77 40MHZ.3 20.32,16.94 20.32,13.08 19.56,12.19 U1.2
N$8
  Top 0.203: LS7366R2.1 12.69,12.85 U1.4 17.74,14.54 R1.2
N$9
  Top 0.203: R1.1 12.59,14.99 LS7366R2.2
N$10
  Top 0.203: LS7366R1.1 15.44,27.3 U2.4 18.25,28.38 R2.2
N$11
  Top 0.152: C5.2 Y1.1 51.98,34.29 R10.1 49.7,32.01 U4.8
PB0
  Top 0.152: U4.12 43.58,38.97 41.66,40.89 M1.D8
PB1/SS_ENC1  (via drill 0.6)
  Top 0.152: U4.13 42.78,38.5 v41.91,39.37 39.12,42.16 M1.D9 | LS7366R1.4 18.41,31.11 19.05,31.75 v22.86,31.75 | v26.67,31.75 29.21,34.29 v29.21,36.83
  Bottom 0.152: v29.21,36.83 31.75,39.37 v41.91,39.37 | v22.86,31.75 v26.67,31.75
PB2/SS_ENC2  (via drill 0.6)
  Top 0.152: U4.14 41.91,33.57 v41.91,35.56 41.91,38.1 36.58,43.43 M1.D10 | LS7366R2.4 14.61,17.14 v16.51,19.05
  Bottom 0.152: v16.51,19.05 29.21,31.75 36.83,31.75 40.64,35.56 v41.91,35.56
PB3/MOSI  (via drill 0.6)
  Top 0.152: M1.D11 34.04,44.7 v40.64,38.1 40.64,35.56 41.18,35.02 U4.15 41.18,32.48 v41.91,31.75 | LS7366R1.7 18.41,34.92 v19.05,35.56 | LS7366R2.7 14.61,20.95 v16.51,22.86
  Bottom 0.152: M1.MOSI 65.97,27.94 64.85,26.82 62.94,26.82 62.48,26.36 43.05,26.36 39.91,29.51 39.91,30.78 40.34,31.21 41.37,31.21 v41.91,31.75 | v16.51,22.86 19.05,25.4 v19.05,35.56 35.56,35.56 38.1,38.1 v40.64,38.1
PB4/MISO  (via drill 0.6)
  Top 0.152: M1.D12 31.5,45.97 39.37,38.1 v39.37,35.56 40.38,34.55 U4.16 40.38,32.01 v41.91,30.48 | LS7366R1.6 18.41,33.66 19.05,34.29 v20.32,34.29 | LS7366R2.6 14.61,19.68 v16.51,21.59
  Bottom 0.152: M1.MISO 60.45,27.18 44.45,27.18 43.94,27.18 43.1,27.18 41.56,28.72 41.56,29.51 41.91,29.86 v41.91,30.48 | v16.51,21.59 20.32,25.4 v20.32,34.29 35.56,34.29 36.83,35.56 v39.37,35.56
PB5/SCK  (via drill 0.6)
  Top 0.152: M1.D13 30.48,49.28 30.48,46.99 31.19,46.28 31.19,45.85 36.83,40.21 v36.83,34.29 36.83,34.07 U4.17 39.75,32 40.64,31.11 v40.64,30.48 | LS7366R1.5 18.41,32.38 19.05,33.02 v21.59,33.02 | LS7366R2.5 14.61,18.41 v16.51,20.32
  Bottom 0.152: M1.SCK 62.36,26.67 43.18,26.67 40.64,29.21 v40.64,30.48 | v16.51,20.32 21.59,25.4 v21.59,33.02 35.56,33.02 v36.83,34.29
RESET  (via drill 0.6)
  Top 0.152: R4.2 56.3,21.59 44.45,21.59 43.58,22.46 U4.29
  Top 0.203: M1.RESET_ICSP 61.09,22.86 58.84,22.86 R4.2 C4.1 R3.1 57.15,17.18 v57.15,15.24
  Bottom 0.152: v57.15,15.24 57.15,13.97 49.53,6.35 35.56,6.35 33.02,3.81 M1.RESET
SCL_3.3V
  Top 0.152: I2C_3.3V.4 8.79,36.7 10.54,36.7 11.14,37.3 R6.2 11.14,40.56 Q2.2
SCL_5V  (via drill 0.6)
  Top 0.152: Q2.3 11.45,43.81 R5.2 13.37,45.12 13.97,45.72 v16.51,45.72
  Bottom 0.152: v16.51,45.72 17.78,45.72 19.05,46.99 I2C_ENABLE.1
SCL_ALT  (6 unrouted)
SDA_3.3V
  Top 0.152: 10.47,45.95 Q1.2 | I2C_3.3V.3 5.58,40.14 5.08,40.64 5.08,43.18 5.84,43.81 9.53,43.81 10.11,44.49 10.76,45.13 R8.2
  Top 0.203: R8.2 10.47,45.87 10.47,45.95
SDA_5V  (via drill 0.6)
  Top 0.152: R7.2 10.33,50.24 Q1.3 12.56,49.39 v12.7,49.53 | I2C_ENABLE.3 17.78,46.99 v13.97,46.99
  Bottom 0.152: v13.97,46.99 13.97,48.26 v12.7,49.53
SDA_ALT  (1 unrouted)